# Altium schematic sheet IO.SchDoc
size A3
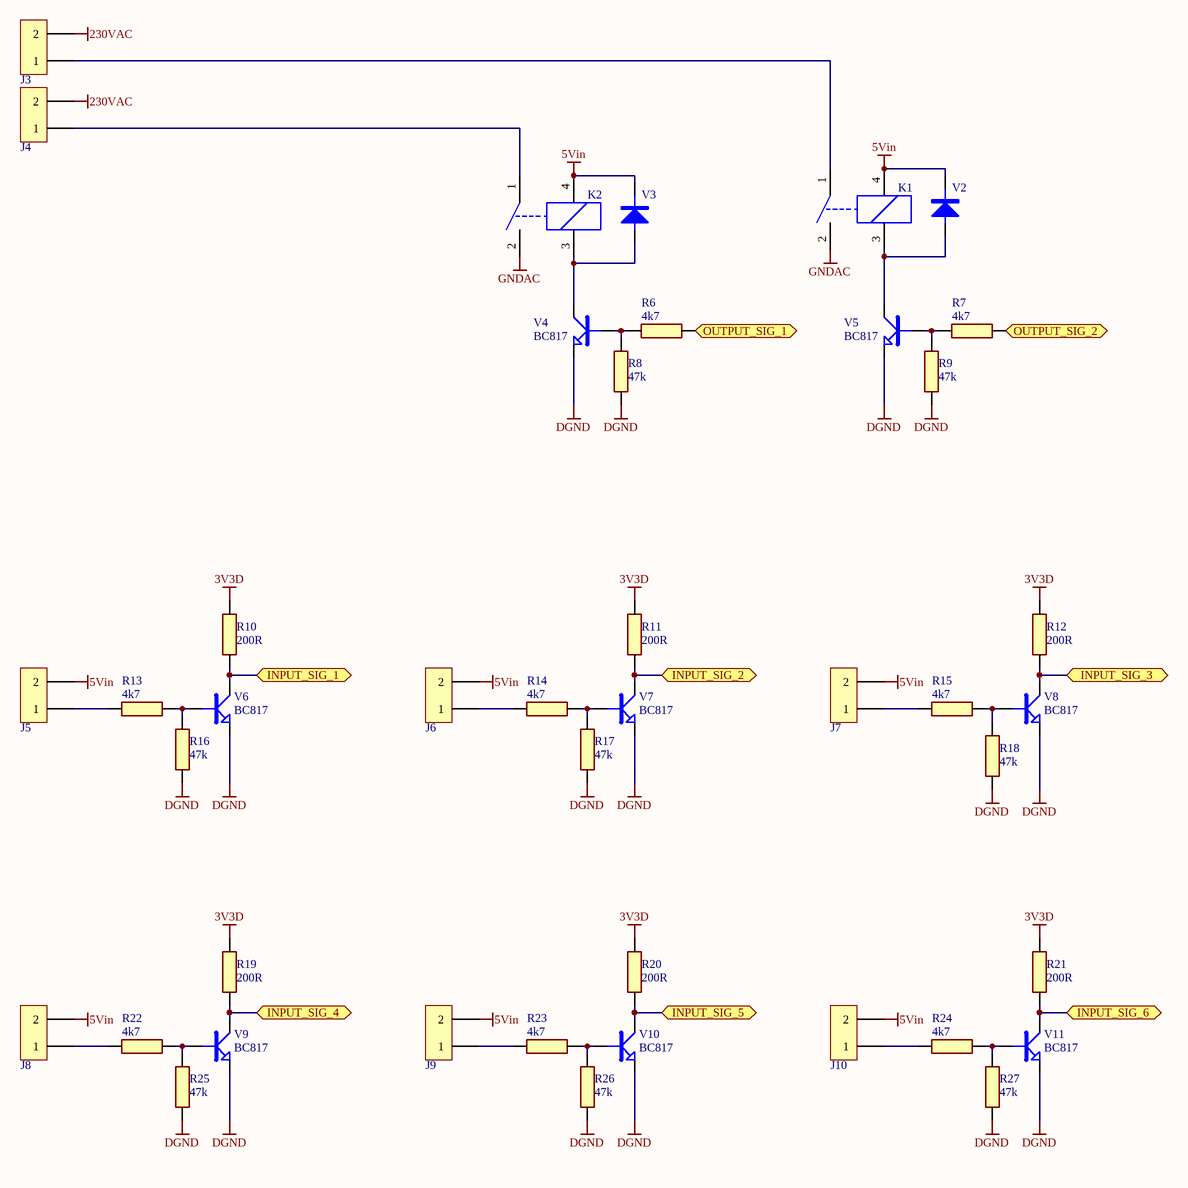
[diagram p0: IO.SchDoc]

## Parts
J3  CON2  [CON-MSTB-5.08-2p]  (value not drawn)
J4  CON2  [CON-MSTB-5.08-2p]  (value not drawn)
J5  CON2  [CON-MSTB-5.08-2p]  (value not drawn)
J6  CON2  [CON-MSTB-5.08-2p]  (value not drawn)
J7  CON2  [CON-MSTB-5.08-2p]  (value not drawn)
J8  CON2  [CON-MSTB-5.08-2p]  (value not drawn)
J9  CON2  [CON-MSTB-5.08-2p]  (value not drawn)
J10  CON2  [CON-MSTB-5.08-2p]  (value not drawn)
K1  RELAY-HF49FD_012-1H12F  [RELAY-HF49FD_012-1H12F]  (value not drawn)
K2  RELAY-HF49FD_012-1H12F  [RELAY-HF49FD_012-1H12F]  (value not drawn)
R6  4k7  [RES_0805_SMD]
R7  4k7  [RES_0805_SMD]
R8  47k  [RES_0805_SMD]
R9  47k  [RES_0805_SMD]
R10  200R  [RES_0805_SMD]
R11  200R  [RES_0805_SMD]
R12  200R  [RES_0805_SMD]
R13  4k7  [RES_0805_SMD]
R14  4k7  [RES_0805_SMD]
R15  4k7  [RES_0805_SMD]
R16  47k  [RES_0805_SMD]
R17  47k  [RES_0805_SMD]
R18  47k  [RES_0805_SMD]
R19  200R  [RES_0805_SMD]
R20  200R  [RES_0805_SMD]
R21  200R  [RES_0805_SMD]
R22  4k7  [RES_0805_SMD]
R23  4k7  [RES_0805_SMD]
R24  4k7  [RES_0805_SMD]
R25  47k  [RES_0805_SMD]
R26  47k  [RES_0805_SMD]
R27  47k  [RES_0805_SMD]
V2  DIODE  [DIODE-0.4_H]  (value not drawn)
V3  DIODE  [DIODE-0.4_H]  (value not drawn)
V4  BC817  [SOT-23_P]
V5  BC817  [SOT-23_P]
V6  BC817  [SOT-23_P]
V7  BC817  [SOT-23_P]
V8  BC817  [SOT-23_P]
V9  BC817  [SOT-23_P]
V10  BC817  [SOT-23_P]
V11  BC817  [SOT-23_P]

## Ports
INPUT_SIG_1 (bidir), INPUT_SIG_2 (bidir), INPUT_SIG_3 (bidir), INPUT_SIG_4 (bidir), INPUT_SIG_5 (bidir), INPUT_SIG_6 (bidir), OUTPUT_SIG_1 (bidir), OUTPUT_SIG_2 (bidir)

## Nets
3V3D: R10.2 R11.2 R12.2 R19.2 R20.2 R21.2
5Vin: J5.2 J6.2 J7.2 J8.2 J9.2 J10.2 K1.4(COIL_2) K2.4(COIL_2) V2.2 V3.2
230VAC: J3.2 J4.2
DGND: R8.1 R9.1 R16.1 R17.2 R18.1 R25.2 R26.1 R27.2 V4.2(E) V5.2(E) V6.2(E) V7.2(E) V8.2(E) V9.2(E) V10.2(E) V11.2(E)
GNDAC: K1.2(NO) K2.2(NO)
INPUT_SIG_1: R10.1 V6.3(C) ; port INPUT_SIG_1
INPUT_SIG_2: R11.1 V7.3(C) ; port INPUT_SIG_2
INPUT_SIG_3: R12.1 V8.3(C) ; port INPUT_SIG_3
INPUT_SIG_4: R19.1 V9.3(C) ; port INPUT_SIG_4
INPUT_SIG_5: R20.1 V10.3(C) ; port INPUT_SIG_5
INPUT_SIG_6: R21.1 V11.3(C) ; port INPUT_SIG_6
OUTPUT_SIG_1: R6.2 ; port OUTPUT_SIG_1
OUTPUT_SIG_2: R7.1 ; port OUTPUT_SIG_2
NetJ3_1: J3.1 K1.1(COM)
NetJ4_1: J4.1 K2.1(COM)
NetJ5_1: J5.1 R13.1
NetJ6_1: J6.1 R14.1
NetJ7_1: J7.1 R15.1
NetJ8_1: J8.1 R22.2
NetJ9_1: J9.1 R23.1
NetJ10_1: J10.1 R24.2
NetK1_3: K1.3(COIL_1) V2.1 V5.3(C)
NetK2_3: K2.3(COIL_1) V3.1 V4.3(C)
NetR6_1: R6.1 R8.2 V4.1(B)
NetR7_2: R7.2 R9.2 V5.1(B)
NetR13_2: R13.2 R16.2 V6.1(B)
NetR14_2: R14.2 R17.1 V7.1(B)
NetR15_2: R15.2 R18.2 V8.1(B)
NetR22_1: R22.1 R25.1 V9.1(B)
NetR23_2: R23.2 R26.2 V10.1(B)
NetR24_1: R24.1 R27.1 V11.1(B)

## Library data of the parts
J3-J10 = CON2: 2 pole connector
K1 K2 = RELAY-HF49FD_012-1H12F: Relay
R6-R27 = RES: 0805
V2 V3 = DIODE: Trough hole diode
V4-V11 = BC817: NPN tranzistor BC-817